# Altium project TIK_HandheldDevice.PrjPcb (part 1 of 2)
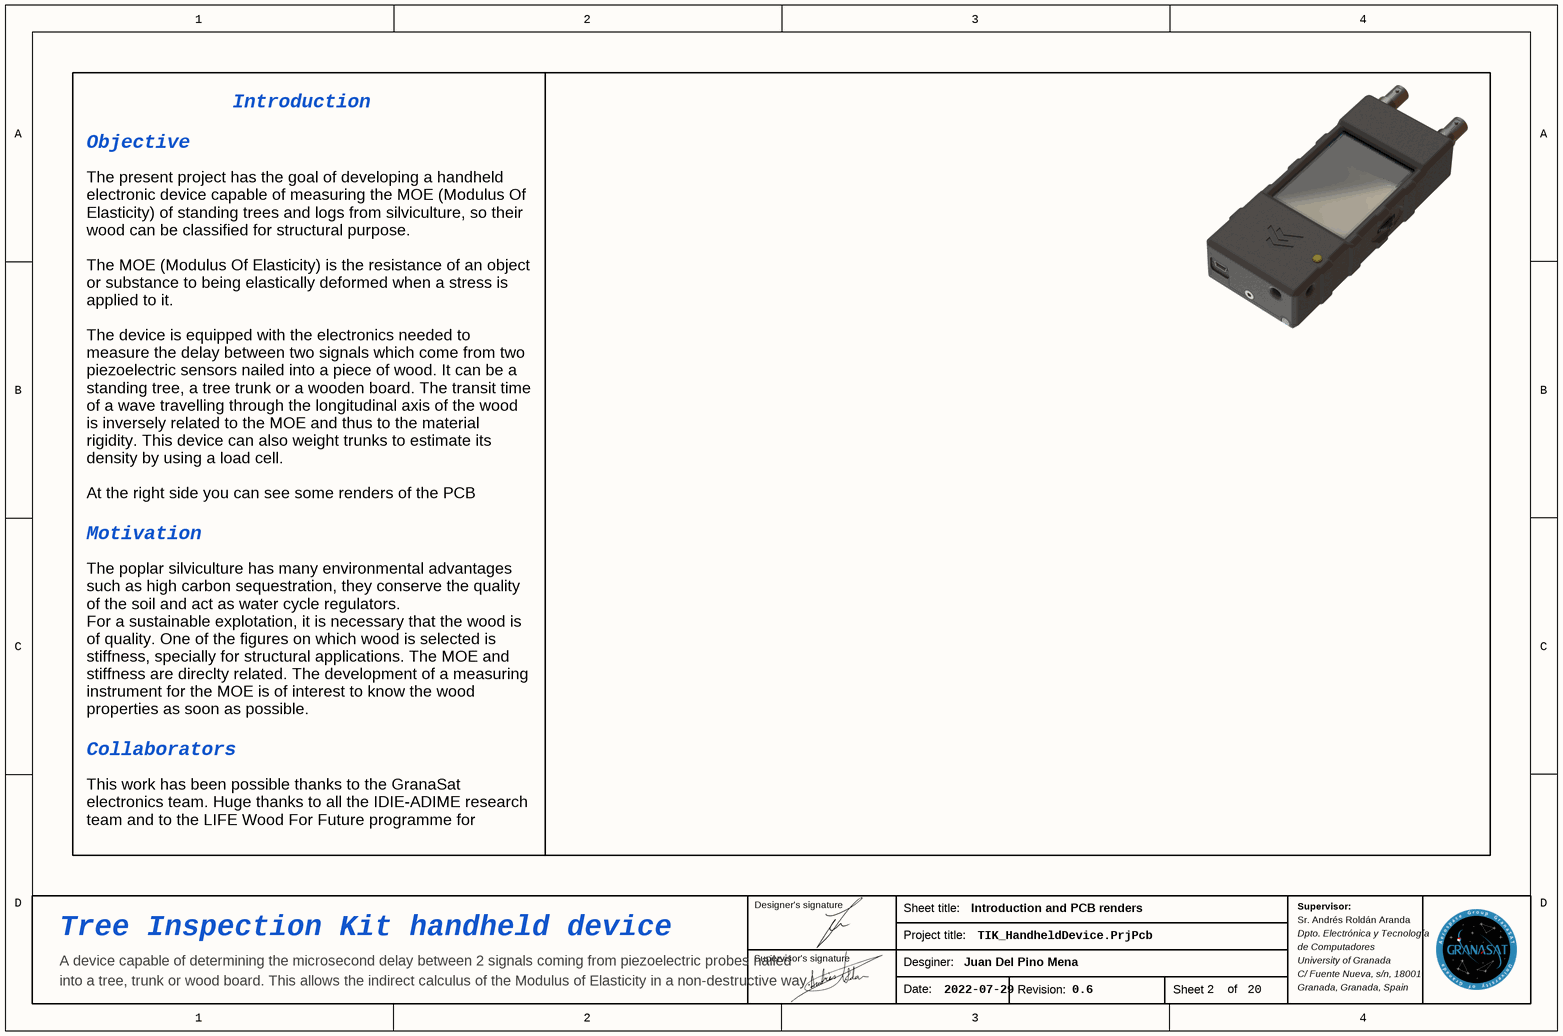
[diagram p0: introduction.SchDoc]
ItemRevision: 6; ProjectAuthor: Juan Del Pino Mena; ProjectDate: 2022-07-29; ProjectRevision: 0.6
21 sheets, 153 parts. Net scope: global (net labels, ports and power ports of the same name join across sheets).
Board file: TIK_PCB.PcbDoc
Sheets:
  cover.SchDoc
  introduction.SchDoc
  changelog.SchDoc
  PCB_traces_vias.SchDoc
  block_diagram.SchDoc
    ESP32-WROOM-32D MCU = esp32_mcu.SchDoc
    SYSTEM POWER RAILS = power_rails.SchDoc
    USB PORT = usb_port.SchDoc
    BUTTONS = buttons.SchDoc
      POWERUP BUTTON = powerup_button.SchDoc
    SIGNAL CONDITIONING = signal_conditioning_circuit.SchDoc
      SIGNAL_CONDITIONING_SIMULATIONS = signal_conditioning_sims1.SchDoc
      Designator = signal_conditioning_sims2.SchDoc
    BATTERY AND CURRENT SENSE = battery_and_current_sense.SchDoc
      CHARGER VARIANT #1: NiMH = battery_charger_ni_mh.SchDoc
      CHARGER VARIANT #2: Li-Ion = battery_charger_li-ion.SchDoc
    MCU AUTO PROGRAMMING = programming.SchDoc
    TFT LCD DISPLAY = tft_lcd_display.SchDoc
    HX711 LOAD CELL AMPLIFIER = HX711_load_cell_amplifier.SchDoc
    EXPANSION_PORT = expansion_port.SchDoc
  power_budget.SchDoc

## Sheet cover.SchDoc
size A4; Date: 2022-07-29; Revision: 0.6; SheetNumber: 1; SheetTotal: 20

### Notes on the sheet
- BACHELOR’S DEGREE IN TELECOMMUNICATION ENGINEERING
- ACADEMIC COURSE 2021/2022
- Tree Inspection Kit
- handheld device
- Part of the Bachelor’s Thesis:
- "Development of an acoustic measurement system of
- the Modulus of Elasticity in trees, logs and boards"
- AUTHOR:
- Sr. Andrés M. Roldán Aranda
- SUPERVISED BY:
- DEPARTMENT:
- Electronics and Computer Technology
- Project title:
- Date:
- Revision:
- Sheet
- of

## Sheet introduction.SchDoc: Introduction and PCB renders
size A4; Date: 2022-07-29; Author: Juan Del Pino Mena; Revision: 0.6; SheetNumber: 2; SheetTotal: 20; TitleBig: Tree Inspection Kit handheld device; Desc_line1: A device capable of determining the microsecond delay between 2 signals coming from piezoelectric probes nailed; Desc_line2: into a tree, trunk or wood board. This allows the indirect calculus of the Modulus of Elasticity in a non-destructive way.

### Notes on the sheet
- Introduction
- Objective
- The present project has the goal of developing a handheld electronic device capable of measuring the MOE (Modulus Of Elasticity) of standing trees and logs from silviculture, so their wood can be classified for structural purpose.
  The MOE (Modulus Of Elasticity) is the resistance of an object or substance to being elastically deformed when a stress is applied to it.
  The device is equipped with the electronics needed to measure the delay between two signals which come from two piezoelectric sensors nailed into a piece of wood. It can be a standing tree, a tree trunk or a wooden board. The transit time of a wave travelling through the longitudinal axis of the wood is inversely related to the MOE and thus to the material rigidity. This device can also weight trunks to estimate its density by using a load cell.
  At the right side you can see some renders of the PCB (version 0.5) which has been manufactured.
- Motivation
- The poplar silviculture has many environmental advantages such as high carbon sequestration, they conserve the quality of the soil and act as water cycle regulators.
  For a sustainable explotation, it is necessary that the wood is of quality. One of the figures on which wood is selected is stiffness, specially for structural applications. The MOE and stiffness are direclty related. The development of a measuring instrument for the MOE is of interest to know the wood properties as soon as possible.
- Collaborators
- This work has been possible thanks to the GranaSat electronics team. Huge thanks to all the IDIE-ADIME research team and to the LIFE Wood For Future programme for offering and financing the project.
- Designer's signature
- Sheet title:
- Sr. Andrés Roldán Aranda
- Supervisor:
- Supervisor's signature
- Project title:
- Desginer:
- Dpto. Electrónica y Tecnología
- de Computadores
- University of Granada
- C/ Fuente Nueva, s/n, 18001
- Granada, Granada, Spain
- Date:
- Revision:
- Sheet
- of

## Sheet changelog.SchDoc: Changelog and document index
size A4; Date: 2022-07-29; Author: Juan Del Pino Mena; Revision: 0.6; SheetNumber: 3; SheetTotal: 20; TitleBig: Document index and revision history; Desc_line1: Detailed changelog and complete document sheets index.; Desc_line2: All along the schematic pages, a sheet title and description will be written on this corner.
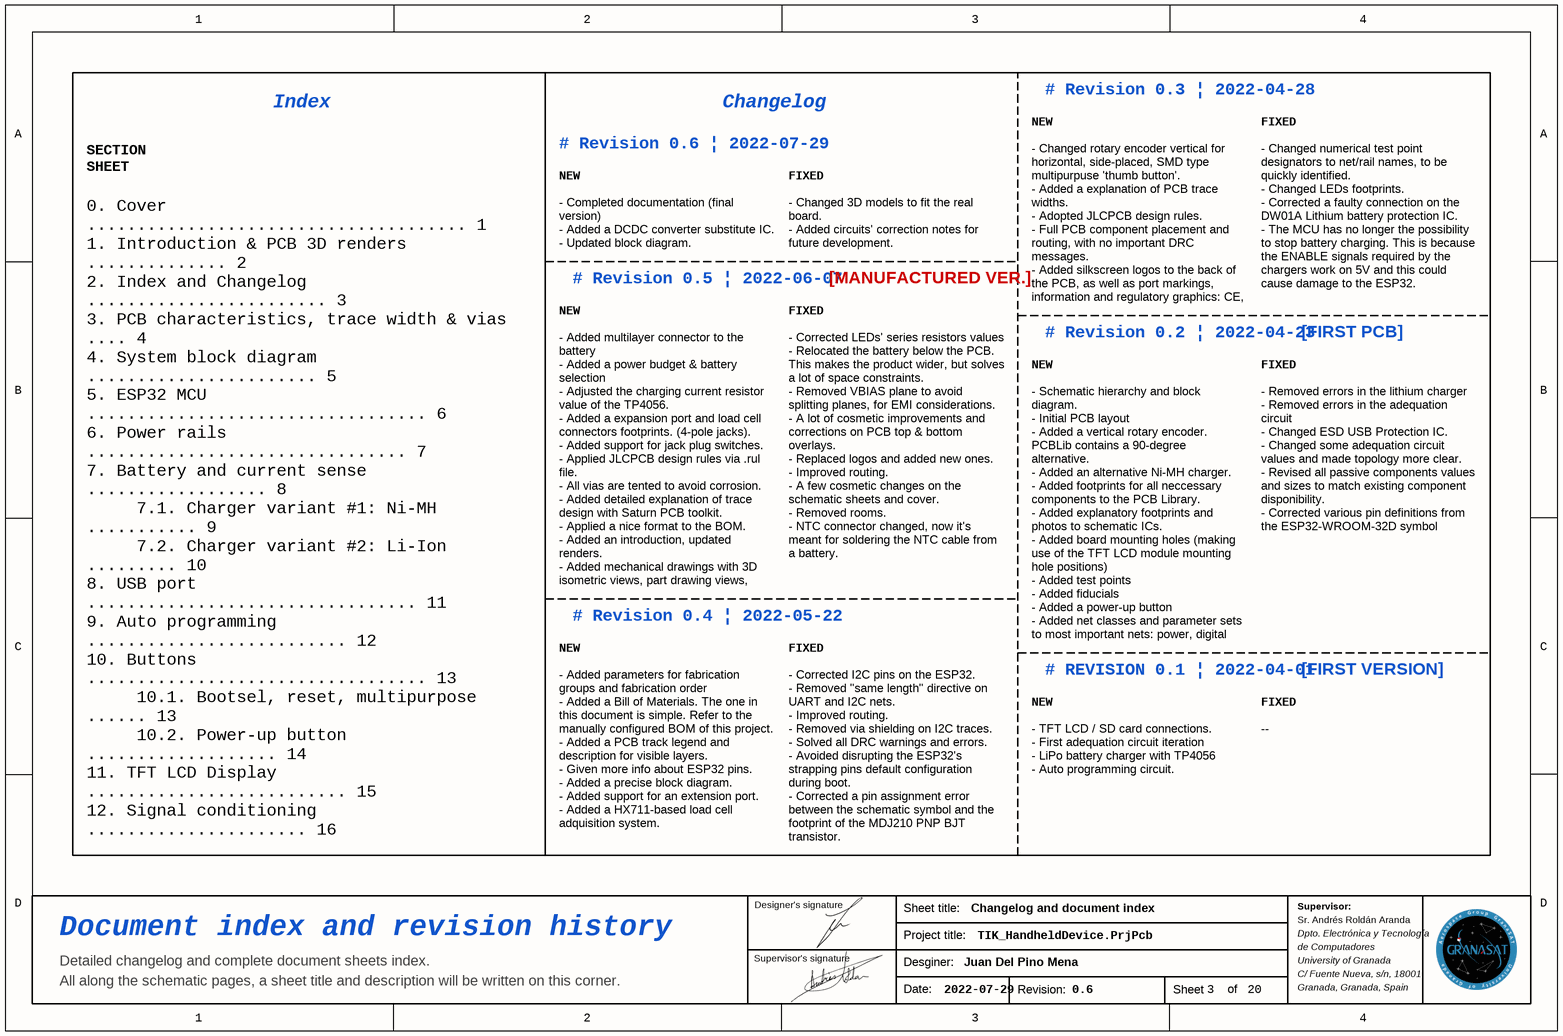
[diagram p1: changelog.SchDoc]

### Notes on the sheet
- Index
- Changelog
- # Revision 0.3 | 2022-04-28
- SECTION                                             SHEET
- # Revision 0.6 | 2022-07-29
- NEW
- FIXED
- - Completed documentation (final version)
  - Added a DCDC converter substitute IC.
  - Updated block diagram.
- - Changed 3D models to fit the real board.
  - Added circuits' correction notes for future development.
- # Revision 0.5 | 2022-06-07
- [MANUFACTURED VER.]
- - Changed rotary encoder vertical for horizontal, side-placed, SMD type multipurpuse 'thumb button'.
  - Added a explanation of PCB trace widths.
  - Adopted JLCPCB design rules.
  - Full PCB component placement and routing, with no important DRC messages.
  - Added silkscreen logos to the back of the PCB, as well as port markings, information and regulatory graphics: CE, WEEE, ESD sensitive warning and RoHS.
- - Changed numerical test point designators to net/rail names, to be quickly identified.
  - Changed LEDs footprints.
  - Corrected a faulty connection on the DW01A Lithium battery protection IC.
  - The MCU has no longer the possibility to stop battery charging. This is because the ENABLE signals required by the chargers work on 5V and this could cause damage to the ESP32.
- # Revision 0.2 | 2022-04-23
- [FIRST PCB]
- - Added multilayer connector to the battery
  - Added a power budget & battery selection
  - Adjusted the charging current resistor value of the TP4056.
  - Added a expansion port and load cell connectors footprints. (4-pole jacks).
  - Added support for jack plug switches.
  - Applied JLCPCB design rules via .rul file.
  - All vias are tented to avoid corrosion.
  - Added detailed explanation of trace design with Saturn PCB toolkit.
  - Applied a nice format to the BOM.
  - Added an introduction, updated renders.
  - Added mechanical drawings with 3D isometric views, part drawing views, measurements, layer stackup, drills, etc.
  - Added Gerber and NC Drills fabrication jobs for ordering PCB and its stencil.
- - Corrected LEDs' series resistors values
  - Relocated the battery below the PCB. This makes the product wider, but solves a lot of space constraints.
  - Removed VBIAS plane to avoid splitting planes, for EMI considerations.
  - A lot of cosmetic improvements and corrections on PCB top & bottom overlays.
  - Replaced logos and added new ones.
  - Improved routing.
  - A few cosmetic changes on the schematic sheets and cover.
  - Removed rooms.
  - NTC connector changed, now it's meant for soldering the NTC cable from a battery.
- # Revision 0.4 | 2022-05-22
- - Schematic hierarchy and block diagram.
  - Initial PCB layout
  - Added a vertical rotary encoder. PCBLib contains a 90-degree alternative.
  - Added an alternative Ni-MH charger.
  - Added footprints for all neccessary components to the PCB Library.
  - Added explanatory footprints and photos to schematic ICs.
  - Added board mounting holes (making use of the TFT LCD module mounting hole positions)
  - Added test points
  - Added fiducials
  - Added a power-up button
  - Added net classes and parameter sets to most important nets: power, digital communications, analog signals, etc.
- - Removed errors in the lithium charger
  - Removed errors in the adequation circuit
  - Changed ESD USB Protection IC.
  - Changed some adequation circuit values and made topology more clear.
  - Revised all passive components values and sizes to match existing component disponibility.
  - Corrected various pin definitions from the ESP32-WROOM-32D symbol
- # REVISION 0.1 | 2022-04-01
- [FIRST VERSION]
- - TFT LCD / SD card connections.
  - First adequation circuit iteration
  - LiPo battery charger with TP4056
  - Auto programming circuit.
- --
- 0. Cover ...................................... 1
  1. Introduction & PCB 3D renders .............. 2
  2. Index and Changelog ........................ 3
  3. PCB characteristics, trace width & vias .... 4
  4. System block diagram ....................... 5
  5. ESP32 MCU .................................. 6
  6. Power rails ................................ 7
  7. Battery and current sense .................. 8
  7.1. Charger variant #1: Ni-MH ........... 9
  7.2. Charger variant #2: Li-Ion ......... 10
  8. USB port  ................................. 11
  9. Auto programming .......................... 12
  10. Buttons .................................. 13
  10.1. Bootsel, reset, multipurpose ...... 13
  10.2. Power-up button ................... 14
  11. TFT LCD Display .......................... 15
  12. Signal conditioning ...................... 16
  12.1. Conditioning circuit .............. 16
  12.2. Circuit simulations 1 ............. 17
  12.3. Circuit simulations 2 ............. 18
  14. Expansion port ........................... 19
  13. Load cell amplifier ...................... 20
  15. Power budget & battery selection ......... 21
  16. 3D PCB (PDF3D) ........................... 22
  17. PCB layers prints ........................ 23
  17.1. Top ............................... 23
  17.2. Bottom ............................ 24
  18. Mechanical schematics (Draftsman) ........ 25
  18.1. Isometric views ................... 25
  18.2. Part views & measurements ......... 26
  18.3. Layer stackup, top/bottom, drills . 27
  18.4. Bill of materials ................. 28
- - Added parameters for fabrication groups and fabrication order
  - Added a Bill of Materials. The one in this document is simple. Refer to the manually configured BOM of this project.
  - Added a PCB track legend and description for visible layers.
  - Given more info about ESP32 pins.
  - Added a precise block diagram.
  - Added support for an extension port.
  - Added a HX711-based load cell adquisition system.
- - Corrected I2C pins on the ESP32.
  - Removed "same length" directive on UART and I2C nets.
  - Improved routing.
  - Removed via shielding on I2C traces.
  - Solved all DRC warnings and errors.
  - Avoided disrupting the ESP32's strapping pins default configuration during boot.
  - Corrected a pin assignment error between the schematic symbol and the footprint of the MDJ210 PNP BJT transistor.
  - Removed PCB cutouts.
- Designer's signature
- Sheet title:
- Sr. Andrés Roldán Aranda
- Supervisor:
- Supervisor's signature
- Project title:
- Desginer:
- Dpto. Electrónica y Tecnología
- de Computadores
- University of Granada
- C/ Fuente Nueva, s/n, 18001
- Granada, Granada, Spain
- Date:
- Revision:
- Sheet
- of

## Sheet PCB_traces_vias.SchDoc: Trace width design
size A4; Date: 2022-07-29; Author: Juan Del Pino Mena; SheetNumber: 4; SheetTotal: 20; TitleBig: Trace & via characteristics; Desc_line1: Trace width based on results from PCB Toolkit by Saturn PCB Design INC.; Desc_line2: Used JLCPCB 2-layer, FR-4, 1.6 mm height, 35 um conductor height (1 oz/ft^2) board characteristics as reference.
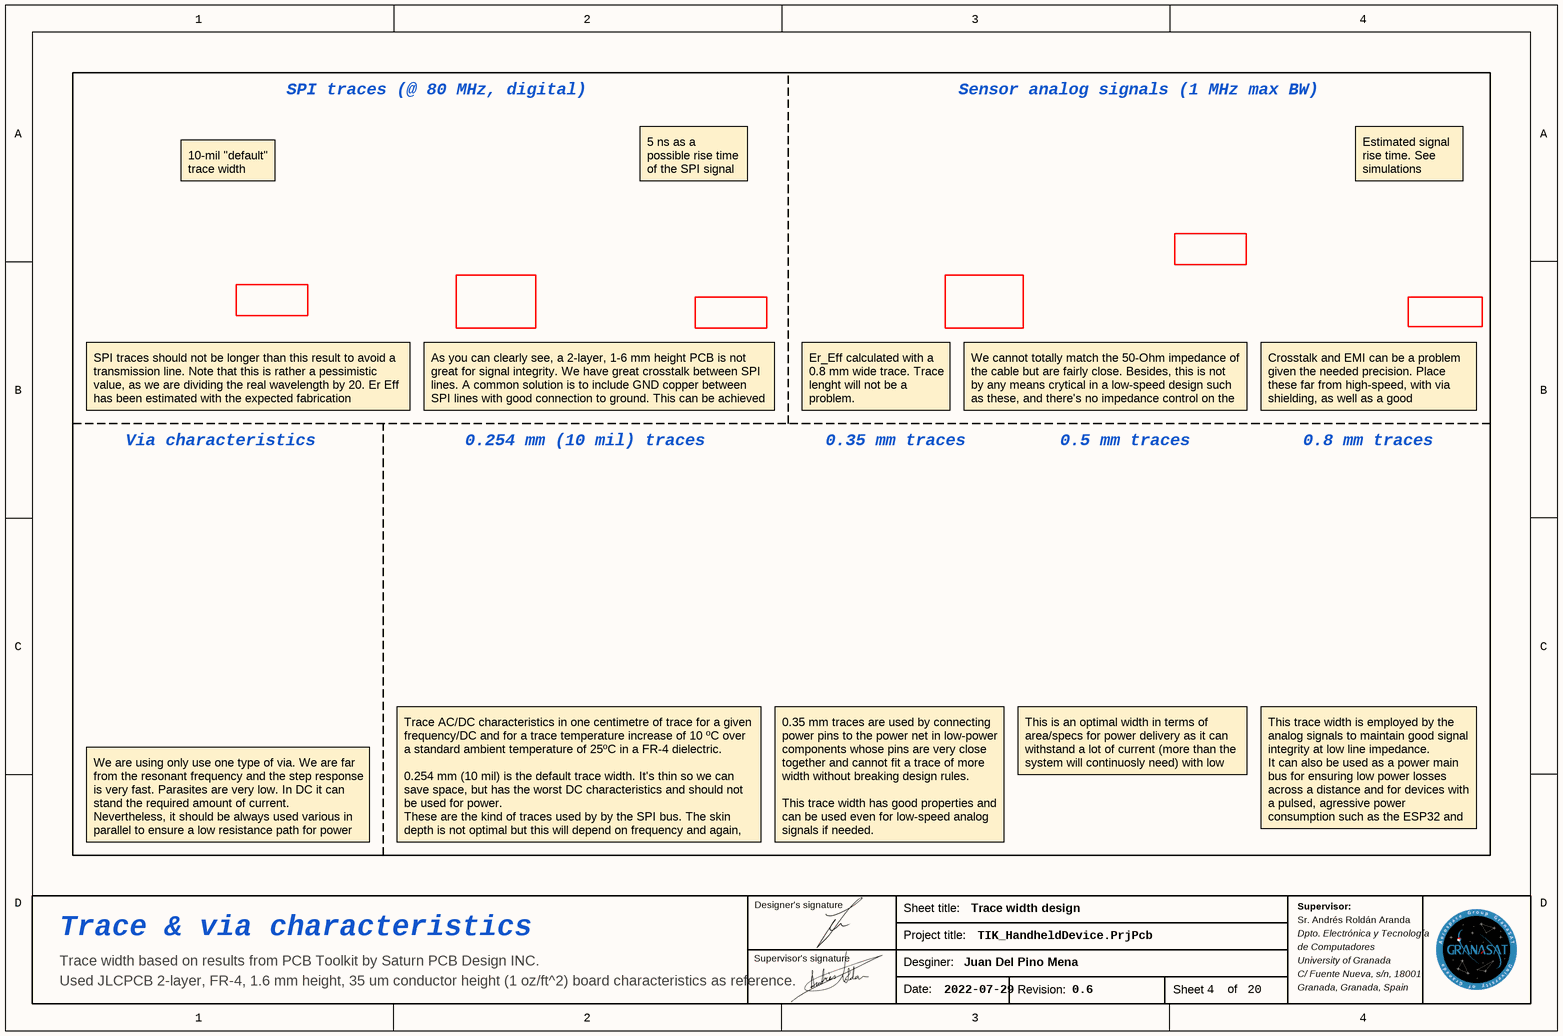
[diagram p2: PCB_traces_vias.SchDoc]

### Notes on the sheet
- SPI traces (@ 80 MHz, digital)
- Sensor analog signals (1 MHz max BW)
- 10-mil "default" trace width
- 5 ns as a possible rise time of the SPI signal
- Estimated signal rise time. See simulations
- SPI traces should not be longer than this result to avoid a transmission line. Note that this is rather a pessimistic value, as we are dividing the real wavelength by 20. Er Eff has been estimated with the expected fabrication characteristics.
- Via characteristics
- As you can clearly see, a 2-layer, 1-6 mm height PCB is not great for signal integrity. We have great crosstalk between SPI lines. A common solution is to include GND copper between SPI lines with good connection to ground. This can be achieved by using via shielding.
- 0.254 mm (10 mil) traces
- Er_Eff calculated with a 0.8 mm wide trace. Trace lenght will not be a problem.
- 0.35 mm traces
- We cannot totally match the 50-Ohm impedance of the cable but are fairly close. Besides, this is not by any means crytical in a low-speed design such as these, and there's no impedance control on the end of the lines
- 0.5 mm traces
- Crosstalk and EMI can be a problem given the needed precision. Place these far from high-speed, with via shielding, as well as a good GND/power planes below.
- 0.8 mm traces
- This is an optimal width in terms of area/specs for power delivery as it can withstand a lot of current (more than the system will continuosly need) with low losses.
- We are using only use one type of via. We are far from the resonant frequency and the step response is very fast. Parasites are very low. In DC it can stand the required amount of current. Nevertheless, it should be always used various in parallel to ensure a low resistance path for power and returning currents.
- Trace AC/DC characteristics in one centimetre of trace for a given frequency/DC and for a trace temperature increase of 10 ºC over a standard ambient temperature of 25ºC in a FR-4 dielectric.
  0.254 mm (10 mil) is the default trace width. It's thin so we can save space, but has the worst DC characteristics and should not be used for power.
  These are the kind of traces used by by the SPI bus. The skin depth is not optimal but this will depend on frequency and again, AC current is not a crytical aspect here. It's a "good enough" approach.
- 0.35 mm traces are used by connecting power pins to the power net in low-power components whose pins are very close together and cannot fit a trace of more width without breaking design rules.
  This trace width has good properties and can be used even for low-speed analog signals if needed.
- This trace width is employed by the analog signals to maintain good signal integrity at low line impedance.
  It can also be used as a power main bus for ensuring low power losses across a distance and for devices with a pulsed, agressive power consumption such as the ESP32 and the LCD.
- Designer's signature
- Sheet title:
- Sr. Andrés Roldán Aranda
- Supervisor:
- Supervisor's signature
- Project title:
- Desginer:
- Dpto. Electrónica y Tecnología
- de Computadores
- University of Granada
- C/ Fuente Nueva, s/n, 18001
- Granada, Granada, Spain
- Date:
- Revision:
- Sheet
- of

## Sheet block_diagram.SchDoc: System blocks organization and connections
size A4; Date: 2022-07-29; Author: Juan Del Pino Mena; Revision: 0.6; SheetNumber: 5; SheetTotal: 20; TitleBig: System blocks organization and connections; Desc_line1: The project's global block diagram. Arrows show how modules are interconnected and include net names.; Desc_line2: PCB includes 3 fiducials for fabrication purposes. GND test points are distributed along the PCB for easy access.
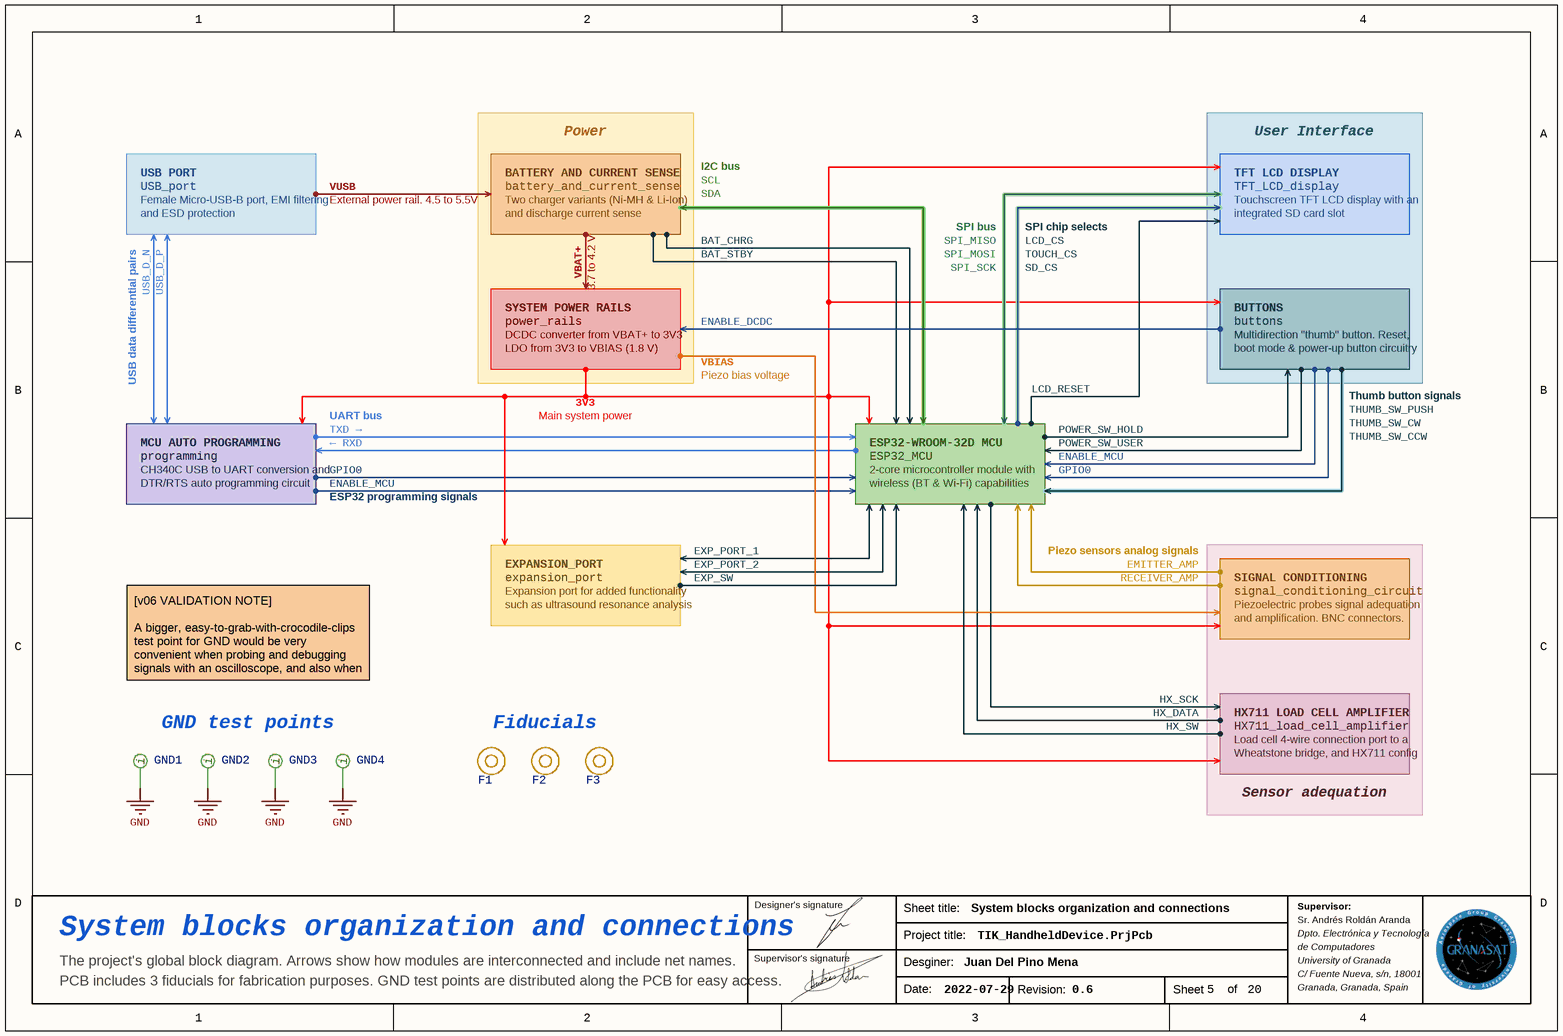
[diagram p3: block_diagram.SchDoc]

### Parts
F1  Fiducial_1mm_2mm  [FIDUCIAL_1MM_2MM]  (value not drawn)  (no BOM)
F2  Fiducial_1mm_2mm  [FIDUCIAL_1MM_2MM]  (value not drawn)  (no BOM)
F3  Fiducial_1mm_2mm  [FIDUCIAL_1MM_2MM]  (value not drawn)  (no BOM)
GND1  Test Point Pad dual sided  [TEST POINT PAD]  (value not drawn)  (no BOM)
GND2  Test Point Pad dual sided  [TEST POINT PAD]  (value not drawn)  (no BOM)
GND3  Test Point Pad dual sided  [TEST POINT PAD]  (value not drawn)  (no BOM)
GND4  Test Point Pad dual sided  [TEST POINT PAD]  (value not drawn)  (no BOM)

### Sub-sheets
BATTERY AND CURRENT SENSE = battery_and_current_sense: no entries
BUTTONS = buttons: no entries
ESP32-WROOM-32D MCU = ESP32_MCU: no entries
EXPANSION_PORT = expansion_port: no entries
HX711 LOAD CELL AMPLIFIER = HX711_load_cell_amplifier: no entries
MCU AUTO PROGRAMMING = programming: no entries
SIGNAL CONDITIONING = signal_conditioning_circuit: no entries
SYSTEM POWER RAILS = power_rails: no entries
TFT LCD DISPLAY = TFT_LCD_display: no entries
USB PORT = USB_port: no entries

### Nets
GND: GND1.1 GND2.1 GND3.1 GND4.1

### Notes on the sheet
- Power
- I2C bus
- User Interface
- USB data differential pairs
- Female Micro-USB-B port, EMI filtering
- and ESD protection
- USB_D_N
- USB_D_P
- VUSB
- External power rail. 4.5 to 5.5V
- Two charger variants (Ni-MH & Li-Ion)
- and discharge current sense
- SDA
- SCL
- BAT_CHRG
- SPI bus
- SPI_MISO
- SPI chip selects
- LCD_CS
- Touchscreen TFT LCD display with an
- integrated SD card slot
- VBAT+
- 3.7 to 4.2 V
- BAT_STBY
- SPI_MOSI
- SPI_SCK
- TOUCH_CS
- SD_CS
- DCDC converter from VBAT+ to 3V3
- LDO from 3V3 to VBIAS (1.8 V)
- ENABLE_DCDC
- VBIAS
- Piezo bias voltage
- Multidirection "thumb" button. Reset,
- boot mode & power-up button circuitry
- TXD →
- ← RXD
- UART bus
- 3V3
- Main system power
- LCD_RESET
- POWER_SW_USER
- POWER_SW_HOLD
- Thumb button signals
- THUMB_SW_CW
- THUMB_SW_PUSH
- THUMB_SW_CCW
- CH340C USB to UART conversion and
- DTR/RTS auto programming circuit
- GPIO0
- ENABLE_MCU
- ESP32 programming signals
- 2-core microcontroller module with
- wireless (BT & Wi-Fi) capabilities
- EXP_PORT_1
- EXP_PORT_2
- EXP_SW
- EMITTER_AMP
- RECEIVER_AMP
- Piezo sensors analog signals
- Expansion port for added functionality
- such as ultrasound resonance analysis
- Piezoelectric probes signal adequation
- and amplification. BNC connectors.
- [v06 VALIDATION NOTE]
  A bigger, easy-to-grab-with-crocodile-clips test point for GND would be very convenient when probing and debugging signals with an oscilloscope, and also when injecting voltage.
- HX_SCK
- HX_DATA
- GND test points
- Fiducials
- HX_SW
- Load cell 4-wire connection port to a
- Wheatstone bridge, and HX711 config
- Sensor adequation
- Designer's signature
- Sheet title:
- Sr. Andrés Roldán Aranda
- Supervisor:
- Supervisor's signature
- Project title:
- Desginer:
- Dpto. Electrónica y Tecnología
- de Computadores
- University of Granada
- C/ Fuente Nueva, s/n, 18001
- Granada, Granada, Spain
- Date:
- Revision:
- Sheet
- of
- (in symbol Test Point Pad dual sided) i

### Library data of the parts
F1-F3 = Fiducial_1mm_2mm: Fiducial 1mm pad, 2mm solder resist
GND1-GND4 = Test Point Pad dual sided: Test point - PCB Pad dual sided

## Sheet esp32_mcu.SchDoc: ESP32-WROOM-32D MCU
size A4; Date: 2022-07-29; Author: Juan Del Pino Mena; Revision: 0.6; SheetNumber: 6; SheetTotal: 20; TitleBig: ESP32-WROOM-32D MCU, Wi-Fi + Bluetooth module; Desc_line1: This module integrates an ESP32-D0WD chip, a 240 MHz, dual-core processor with Wi-Fi and Bluetooth capabilities.; Desc_line2: This sheet describes its hardware configuration and I/O pins
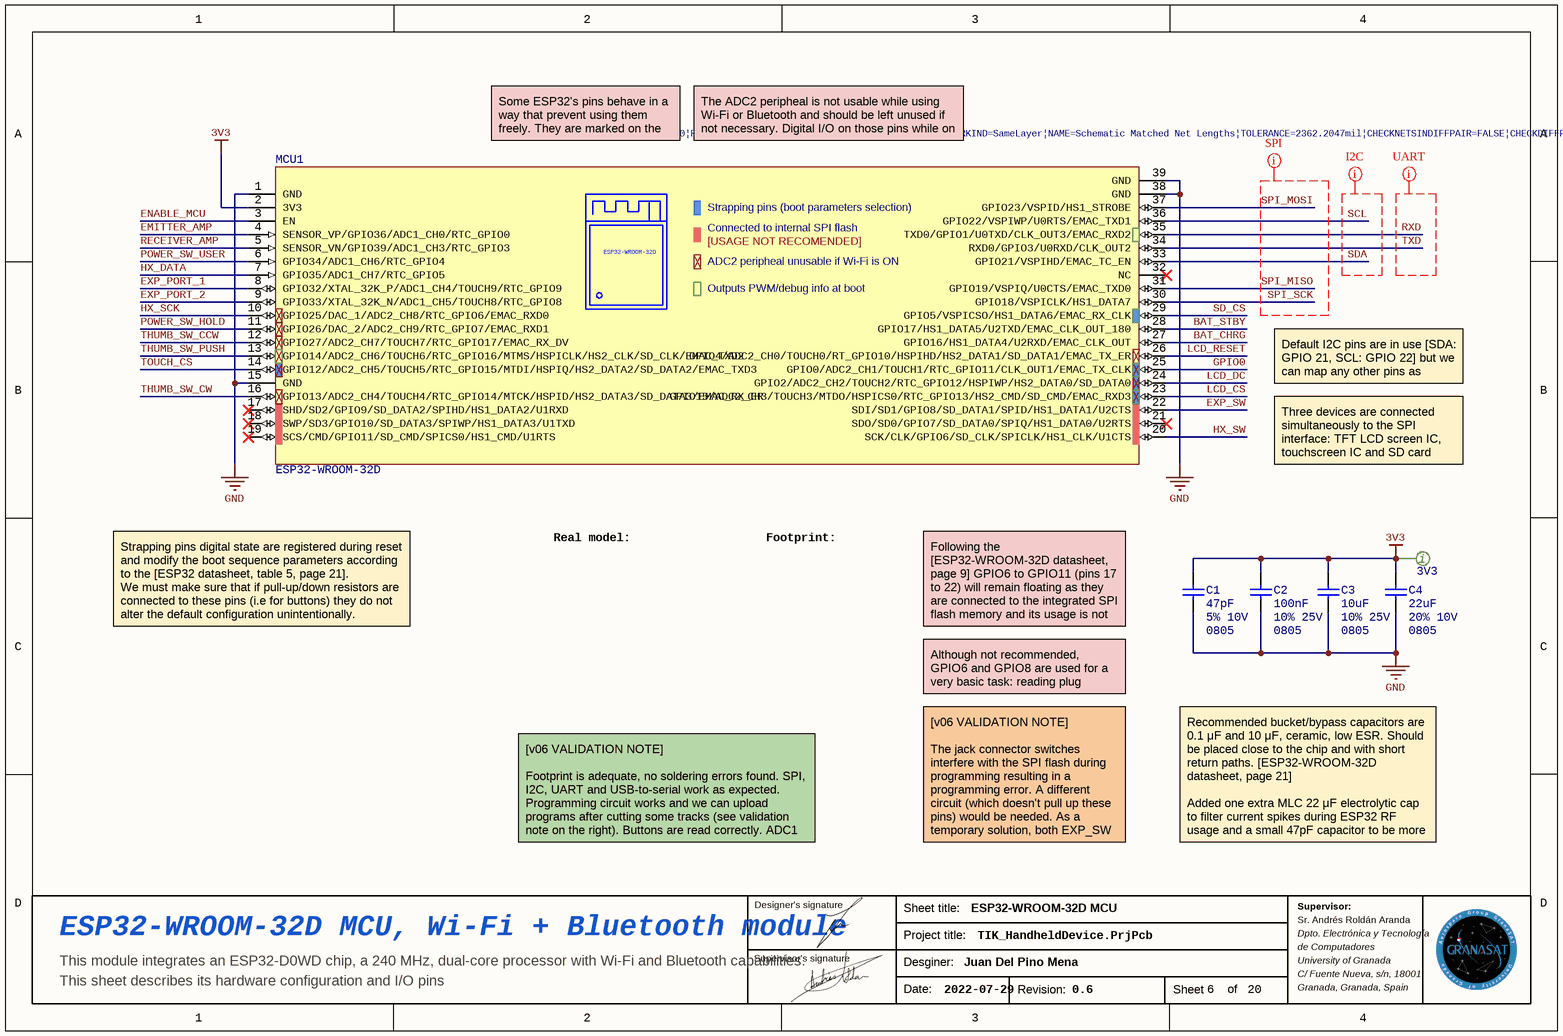
[diagram p4: esp32_mcu.SchDoc]

### Parts
3V3  Test Point Pad dual sided  [TEST POINT PAD]  (value not drawn)  (no BOM)
C1  value 47pF  Tolerance: 5% 10V  PackageDescription: 0805  [CAP 0805_2012]  (hidden comment: Cap_cer_0805)
C2  value 100nF  Tolerance: 10% 25V  PackageDescription: 0805  [CAP 0805_2012]  (hidden comment: Cap_cer_0805)
C3  value 10uF  Tolerance: 10% 25V  PackageDescription: 0805  [CAP 0805_2012]  (hidden comment: Cap_cer_0805)
C4  value 22uF  Tolerance: 20% 10V  PackageDescription: 0805  [CAP 0805_2012]  (hidden comment: Cap_cer_0805)
MCU1  Part: ESP32-WROOM-32D  [MODULE_ESP32-WROOM-32]  (hidden comment: MCU ESP32-WROOM-32D)

### Nets
3V3: 3V3.1 C1.2 C2.2 C3.2 C4.2 MCU1.2(3V3)
GND: C1.1 C2.1 C3.1 C4.1 MCU1.1(GND) MCU1.15(GND) MCU1.38(GND) MCU1.39(GND)
BAT_CHRG: MCU1.27(GPIO16/HS1_DATA4/U2RXD/EMAC_CLK_OUT)
BAT_STBY: MCU1.28(GPIO17/HS1_DATA5/U2TXD/EMAC_CLK_OUT_180)
EMITTER_AMP: MCU1.4(SENSOR_VP/GPIO36/ADC1_CH0/RTC_GPIO0)
ENABLE_MCU: MCU1.3(EN)
EXP_PORT_1: MCU1.8(GPIO32/XTAL_32K_P/ADC1_CH4/TOUCH9/RTC_GPIO9)
EXP_PORT_2: MCU1.9(GPIO33/XTAL_32K_N/ADC1_CH5/TOUCH8/RTC_GPIO8)
EXP_SW: MCU1.22(SDI/SD1/GPIO8/SD_DATA1/SPID/HS1_DATA1/U2CTS)
GPIO0: MCU1.25(GPIO0/ADC2_CH1/TOUCH1/RTC_GPIO11/CLK_OUT1/EMAC_TX_CLK)
HX_DATA: MCU1.7(GPIO35/ADC1_CH7/RTC_GPIO5)
HX_SCK: MCU1.10(GPIO25/DAC_1/ADC2_CH8/RTC_GPIO6/EMAC_RXD0)
HX_SW: MCU1.20(SCK/CLK/GPIO6/SD_CLK/SPICLK/HS1_CLK/U1CTS)
LCD_CS: MCU1.23(GPIO15/ADC2_CH3/TOUCH3/MTDO/HSPICS0/RTC_GPIO13/HS2_CMD/SD_CMD/EMAC_RXD3)
LCD_DC: MCU1.24(GPIO2/ADC2_CH2/TOUCH2/RTC_GPIO12/HSPIWP/HS2_DATA0/SD_DATA0)
LCD_RESET: MCU1.26(GPIO4/ADC2_CH0/TOUCH0/RT_GPIO10/HSPIHD/HS2_DATA1/SD_DATA1/EMAC_TX_ER)
POWER_SW_HOLD: MCU1.11(GPIO26/DAC_2/ADC2_CH9/RTC_GPIO7/EMAC_RXD1)
POWER_SW_USER: MCU1.6(GPIO34/ADC1_CH6/RTC_GPIO4)
RECEIVER_AMP: MCU1.5(SENSOR_VN/GPIO39/ADC1_CH3/RTC_GPIO3)
RXD: MCU1.35(TXD0/GPIO1/U0TXD/CLK_OUT3/EMAC_RXD2)
SCL: MCU1.36(GPIO22/VSPIWP/U0RTS/EMAC_TXD1)
SD_CS: MCU1.29(GPIO5/VSPICSO/HS1_DATA6/EMAC_RX_CLK)
SDA: MCU1.33(GPIO21/VSPIHD/EMAC_TC_EN)
SPI_MISO: MCU1.31(GPIO19/VSPIQ/U0CTS/EMAC_TXD0)
SPI_MOSI: MCU1.37(GPIO23/VSPID/HS1_STROBE)
SPI_SCK: MCU1.30(GPIO18/VSPICLK/HS1_DATA7)
THUMB_SW_CCW: MCU1.12(GPIO27/ADC2_CH7/TOUCH7/RTC_GPIO17/EMAC_RX_DV)
THUMB_SW_CW: MCU1.16(GPIO13/ADC2_CH4/TOUCH4/RTC_GPIO14/MTCK/HSPID/HS2_DATA3/SD_DATA3/EMAC_RX_ER)
THUMB_SW_PUSH: MCU1.13(GPIO14/ADC2_CH6/TOUCH6/RTC_GPIO16/MTMS/HSPICLK/HS2_CLK/SD_CLK/EMAC_TXD2)
TOUCH_CS: MCU1.14(GPIO12/ADC2_CH5/TOUCH5/RTC_GPIO15/MTDI/HSPIQ/HS2_DATA2/SD_DATA2/EMAC_TXD3)
TXD: MCU1.34(RXD0/GPIO3/U0RXD/CLK_OUT2)

Not connected (* = marked no-connect by the designer): MCU1 17(SHD/SD2/GPIO9/SD_DATA2/SPIHD/HS1_DATA2/U1RXD)* 18(SWP/SD3/GPIO10/SD_DATA3/SPIWP/HS1_DATA3/U1TXD)* 19(SCS/CMD/GPIO11/SD_CMD/SPICS0/HS1_CMD/U1RTS)* 21(SDO/SD0/GPIO7/SD_DATA0/SPIQ/HS1_DATA0/U2RTS)* 32(NC)*

### Layout directives
net class I2C; rule Matched Net Lengths [Tolerance = 100mm]: SCL, SDA
net class UART; rule Matched Net Lengths [Tolerance = 100mm]: RXD, TXD
net class SPI; rule Matched Net Lengths [Tolerance = 60mm]: SPI_MISO, SPI_MOSI, SPI_SCK

### Notes on the sheet
- (near MCU1) Some ESP32's pins behave in a way that prevent using them freely. They are marked on the legend below.
- (near MCU1) The ADC2 peripheal is not usable while using Wi-Fi or Bluetooth and should be left unused if not necessary. Digital I/O on those pins while on Wi-Fi or BT is fine.
- Default I2C pins are in use [SDA: GPIO 21, SCL: GPIO 22] but we can map any other pins as hardware I2C.
- Three devices are connected simultaneously to the SPI interface: TFT LCD screen IC, touchscreen IC and SD card reader.
- Real model:
- Footprint:
- Strapping pins digital state are registered during reset and modify the boot sequence parameters according to the [ESP32 datasheet, table 5, page 21].
  We must make sure that if pull-up/down resistors are connected to these pins (i.e for buttons) they do not alter the default configuration unintentionally.
- Following the [ESP32-WROOM-32D datasheet, page 9] GPIO6 to GPIO11 (pins 17 to 22) will remain floating as they are connected to the integrated SPI flash memory and its usage is not recommended for other uses.
- Although not recommended, GPIO6 and GPIO8 are used for a very basic task: reading plug switches.
- [v06 VALIDATION NOTE]
  Footprint is adequate, no soldering errors found. SPI, I2C, UART and USB-to-serial work as expected. Programming circuit works and we can upload programs after cutting some tracks (see validation note on the right). Buttons are read correctly. ADC1 can register analog signals correctly.
- [v06 VALIDATION NOTE]
  The jack connector switches interfere with the SPI flash during programming resulting in a programming error. A different circuit (which doesn't pull up these pins) would be needed. As a temporary solution, both EXP_SW and HX_SW tracks were cut in the PCB.
- Recommended bucket/bypass capacitors are 0.1 μF and 10 μF, ceramic, low ESR. Should be placed close to the chip and with short return paths. [ESP32-WROOM-32D datasheet, page 21]
  Added one extra MLC 22 μF electrolytic cap to filter current spikes during ESP32 RF usage and a small 47pF capacitor to be more effective filtering high frequencies
- Designer's signature
- Sheet title:
- Sr. Andrés Roldán Aranda
- Supervisor:
- Supervisor's signature
- Project title:
- Desginer:
- Dpto. Electrónica y Tecnología
- de Computadores
- University of Granada
- C/ Fuente Nueva, s/n, 18001
- Granada, Granada, Spain
- Date:
- Revision:
- Sheet
- of
- (in symbol MCU ESP32-WROOM-32D) Strapping pins (boot parameters selection); Connected to internal SPI flash; [USAGE NOT RECOMENDED]; ADC2 peripheal unusable if Wi-Fi is ON; Outputs PWM/debug info at boot
- (in symbol Test Point Pad dual sided) i

### Library data of the parts
3V3 = Test Point Pad dual sided: Test point - PCB Pad dual sided
C1 = Cap_cer_0805_47pF_5%: Ceramic cap size 0805; FabGroup: Microcontroller; FabOrder: 1
C2 = Cap_cer_0805_100nF_10%: Ceramic cap size 0805; FabGroup: Microcontroller; FabOrder: 1
C3 = Cap_cer_0805_10uF_10%: Ceramic cap size 0805; FabGroup: Microcontroller; FabOrder: 1
C4 = Cap_cer_0805_22uF_20%: Ceramic cap size 0805 CC0805MKX5R6BB226 Yageo MLCC 22uF 10V 20% X5R
MCU1 = MCU ESP32-WROOM-32D: - Transceiver; 802.11 b/g/n _Wi-Fi, WiFi, WLAN_, Bluetooth Smart Ready 4.x Dual Mode For Use With ESP-WROOM-32; MF: Espressif Systems; FabGroup: Microcontroller; FabOrder: 1; Package: None; Price: None; Availability: Unavailable; MP: ESP32-WROOM-32D; SnapEDA_Link: https://www.snapeda.com/parts/ESP32-DEVKITC-32D/Espressif%20Systems/view-part/2777395/?ref=snap; Value: *

## Sheet power_rails.SchDoc: Power rails
size A4; Date: 2022-07-29; Author: Juan Del Pino Mena; Revision: 0.6; SheetNumber: 7; SheetTotal: 20; TitleBig: Power rails; Desc_line1: Battery DC/DC step-down converter and Vbias for signal conditioning circuit. 3V3 is the main system power and can; Desc_line2: deliver upto 2 amps. VBIAS is only for polarization of the probes and won't drag much current.
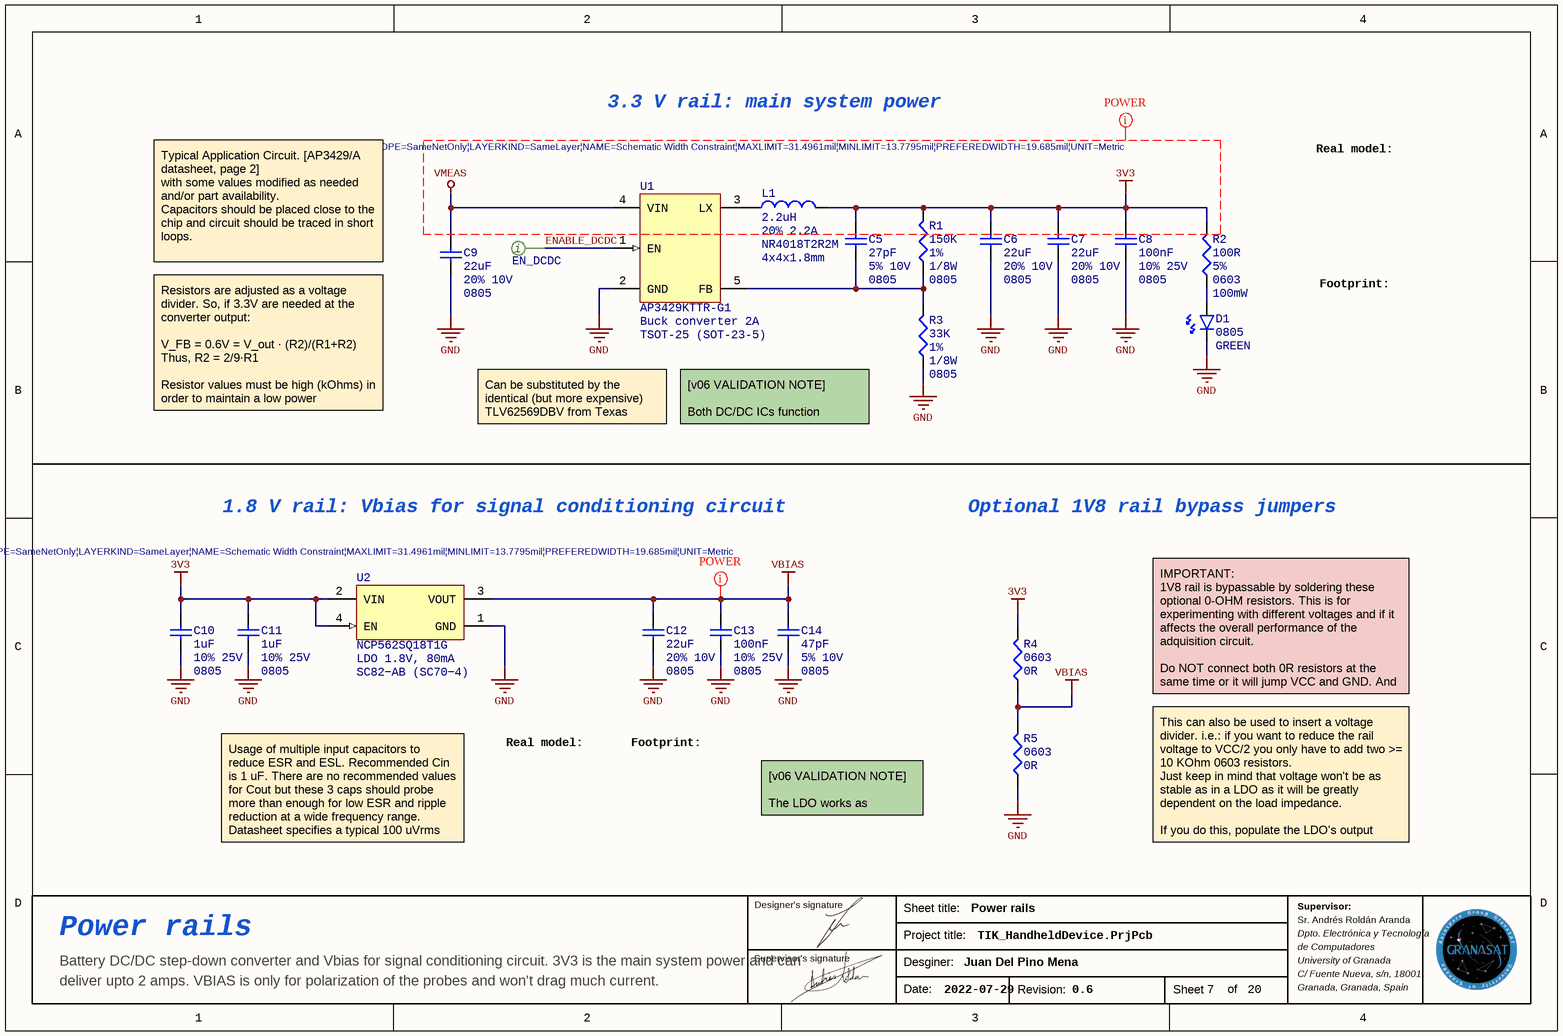
[diagram p5: power_rails.SchDoc]

### Parts
C5  value 27pF  Tolerance: 5% 10V  PackageDescription: 0805  [CAP 0805_2012]  (hidden comment: Cap_cer_0805)
C6  value 22uF  Tolerance: 20% 10V  PackageDescription: 0805  [CAP 0805_2012]  (hidden comment: Cap_cer_0805)
C7  value 22uF  Tolerance: 20% 10V  PackageDescription: 0805  [CAP 0805_2012]  (hidden comment: Cap_cer_0805)
C8  value 100nF  Tolerance: 10% 25V  PackageDescription: 0805  [CAP 0805_2012]  (hidden comment: Cap_cer_0805)
C9  value 22uF  Tolerance: 20% 10V  PackageDescription: 0805  [CAP 0805_2012]  (hidden comment: Cap_cer_0805)
C10  value 1uF  Tolerance: 10% 25V  PackageDescription: 0805  [CAP 0805_2012]  (hidden comment: Cap_cer_0805)
C11  value 1uF  Tolerance: 10% 25V  PackageDescription: 0805  [CAP 0805_2012]  (hidden comment: Cap_cer_0805)
C12  value 22uF  Tolerance: 20% 10V  PackageDescription: 0805  [CAP 0805_2012]  (hidden comment: Cap_cer_0805)
C13  value 100nF  Tolerance: 10% 25V  PackageDescription: 0805  [CAP 0805_2012]  (hidden comment: Cap_cer_0805)
C14  value 47pF  Tolerance: 5% 10V  PackageDescription: 0805  [CAP 0805_2012]  (hidden comment: Cap_cer_0805)
D1  PackageDescription: 0805  Type: GREEN  [LED 0805_2012 GREEN]  (hidden comment: Diode LED_G_0805)
EN_DCDC  Test Point Pad dual sided  [TEST POINT PAD]  (value not drawn)  (no BOM)
L1  value 2.2uH  Tolerance: 20% 2.2A  Part: NR4018T2R2M  PackageDescription: 4x4x1.8mm  [Inductor 4x4mm]  (hidden comment: Ind 2uH_Wire_Shield_2A_4x4)
R1  value 150K  Tolerance: 1%  PowerDisipated: 1/8W  PackageDescription: 0805  [RES 0805_2012]  (hidden comment: Res_0805_150K_1%_1/8W)
R2  value 100R  Tolerance: 5%  PackageDescription: 0603  PowerDisipated: 100mW  [RES 0603_1608]  (hidden comment: Res_0603_100R_5%_100mW)
R3  value 33K  Tolerance: 1%  PowerDisipated: 1/8W  PackageDescription: 0805  [RES 0805_2012]  (hidden comment: Res_0805_33K_1%_1/8W)
R4  value 0R  PackageDescription: 0603  [RES 0603_1608]  (hidden comment: Res_0603_0ohm)
R5  value 0R  PackageDescription: 0603  [RES 0603_1608]  (hidden comment: Res_0603_0ohm)
U1  Part: AP3429KTTR-G1  Type: Buck converter 2A  PackageDescription: TSOT-25 (SOT-23-5)  [SOT-23-5 AP3429]  (hidden comment: AP3429_A)
U2  value LDO 1.8V, 80mA  Part: NCP562SQ18T1G  PackageDescription: SC82−AB (SC70−4)  [SC70-5 LT SC82-AB NCP562]  (hidden comment: IC NCP562SQ18T1G LDO)

### Nets
3V3: C5.2 C6.2 C7.2 C8.2 C10.2 C11.2 L1.2 R1.2 R2.2 R4.2 U2.2(VIN) U2.4(EN)
GND: C6.1 C7.1 C8.1 C9.1 C10.1 C11.1 C12.1 C13.1 C14.1 D1.2 R3.1 R5.1 U1.2(GND) U2.1(GND)
VBIAS: C12.2 C13.2 C14.2 R4.1 R5.2 U2.3(VOUT)
VMEAS: C9.2 U1.4(VIN)
ENABLE_DCDC: EN_DCDC.1 U1.1(EN)
NetC5_1: C5.1 R1.1 R3.2 U1.5(FB)
NetD1_1: D1.1 R2.1
NetL1_1: L1.1 U1.3(LX)

### Layout directives
net class POWER; rule Width Constraint [Pref Width = 0.5mm    Min Width = 0.35mm    Max Width = 0.8mm]: 3V3, VBIAS, VMEAS

### Notes on the sheet
- 3.3 V rail: main system power
- Real model:
- Typical Application Circuit. [AP3429/A datasheet, page 2]
  with some values modified as needed and/or part availability.
  Capacitors should be placed close to the chip and circuit should be traced in short loops.
  Feedback voltage V_FB is regulated at 0.6 V.
- Footprint:
- Resistors are adjusted as a voltage divider. So, if 3.3V are needed at the converter output:
  V_FB = 0.6V = V_out · (R2)/(R1+R2)
  Thus, R2 = 2/9·R1
  Resistor values must be high (kOhms) in order to maintain a low power consumption on the feedback circuit.
- Can be substituted by the identical (but more expensive) TLV62569DBV from Texas Instruments
- [v06 VALIDATION NOTE]
  Both DC/DC ICs function properly.
- 1.8 V rail: Vbias for signal conditioning circuit
- Optional 1V8 rail bypass jumpers
- IMPORTANT:
  1V8 rail is bypassable by soldering these optional 0-OHM resistors. This is for experimenting with different voltages and if it affects the overall performance of the adquisition circuit.
  Do NOT connect both 0R resistors at the same time or it will jump VCC and GND. And keep the LDO disabled at all times.
- Usage of multiple input capacitors to reduce ESR and ESL. Recommended Cin is 1 uF. There are no recommended values for Cout but these 3 caps should probe more than enough for low ESR and ripple reduction at a wide frequency range.
  Datasheet specifies a typical 100 uVrms noise on Vout, somewhat high.
- [v06 VALIDATION NOTE]
  The LDO works as expected.
- This can also be used to insert a voltage divider. i.e.: if you want to reduce the rail voltage to VCC/2 you only have to add two >= 10 KOhm 0603 resistors.
  Just keep in mind that voltage won't be as stable as in a LDO as it will be greatly dependent on the load impedance.
  If you do this, populate the LDO's output caps, so VBIAS it behaves as a small-signal GND.
- Designer's signature
- Sheet title:
- Sr. Andrés Roldán Aranda
- Supervisor:
- Supervisor's signature
- Project title:
- Desginer:
- Dpto. Electrónica y Tecnología
- de Computadores
- University of Granada
- C/ Fuente Nueva, s/n, 18001
- Granada, Granada, Spain
- Date:
- Revision:
- Sheet
- of
- (in symbol Test Point Pad dual sided) i

### Library data of the parts
C5 = Cap_cer_0805_27pF_5%: Ceramic cap size 0805; FabGroup: DCDC converter; FabOrder: 2
C6 C7 C9 = Cap_cer_0805_22uF_20%: Ceramic cap size 0805 CC0805MKX5R6BB226 Yageo MLCC 22uF 10V 20% X5R; FabGroup: DCDC converter; FabOrder: 2
C8 = Cap_cer_0805_100nF_10%: Ceramic cap size 0805; FabGroup: DCDC converter; FabOrder: 2
C10 C11 = Cap_cer_0805_1uF_10%: Ceramic cap size 0805; FabGroup: LDO Regulator & LDO bypass; FabOrder: 12
C12 = Cap_cer_0805_22uF_20%: Ceramic cap size 0805 CC0805MKX5R6BB226 Yageo MLCC 22uF 10V 20% X5R; FabGroup: LDO Regulator & LDO bypass; FabOrder: 12
C13 = Cap_cer_0805_100nF_10%: Ceramic cap size 0805; FabGroup: LDO Regulator & LDO bypass; FabOrder: 12
C14 = Cap_cer_0805_47pF_5%: Ceramic cap size 0805; FabGroup: LDO Regulator & LDO bypass; FabOrder: 12
D1 = Diode LED_G_0805: Low power LED color Green; FabGroup: DCDC converter; FabOrder: 2
EN_DCDC = Test Point Pad dual sided: Test point - PCB Pad dual sided
L1 = Ind 2uH_Wire_Shield_2A_4x4: Shielded Power Inductor 2.2 uH 20% 2.2 A 50.4 mohms 3.11 A (sat) 60MHz / 4018: 4x4x1.8mm; FabGroup: DCDC converter; FabOrder: 2
R1 = Res_0805_150K_1%_1/8W: Res size 0805 SMD mounting, low power / Yageo-RC0805FR-07150KL
R2 = Res_0603_100R_5%_100mW: Res size 0603 SMD mounting, low power
R3 = Res_0805_33K_1%_1/8W: Res size 0805 SMD mounting, low power
R4 R5 = Res_0603_0ohm: Res size 0603 SMD mounting, zero-ohm 0R Yageo RC0603JR-070RL; Tolerance: 5%; PowerDisipated: 100mW; FabGroup: LDO Regulator & LDO bypass; FabOrder: 12
U1 = IC AP3429_A dcdc buck: 1.0MHZ, 2A STEP-DOWN DC-DC BUCK CONVERTER, with latch-off protection
U2 = IC NCP562SQ18T1G LDO: Fixed output lowdropout linear regulator. / 1.8 V 80 mA; Type: LDO

## Sheet usb_port.SchDoc: USB connector and ESD protection circuit
size A4; Date: 2022-07-29; Author: Juan Del Pino Mena; Revision: 0.6; SheetNumber: 11; SheetTotal: 18; TitleBig: USB connector and ESD protection circuit; Desc_line1: USB is used as a programming interface, as well as a power source for the charging circuit. Since it's an external; Desc_line2: connector, it needs to have a protection circuit against electro-static discharge (ESD) and noise.
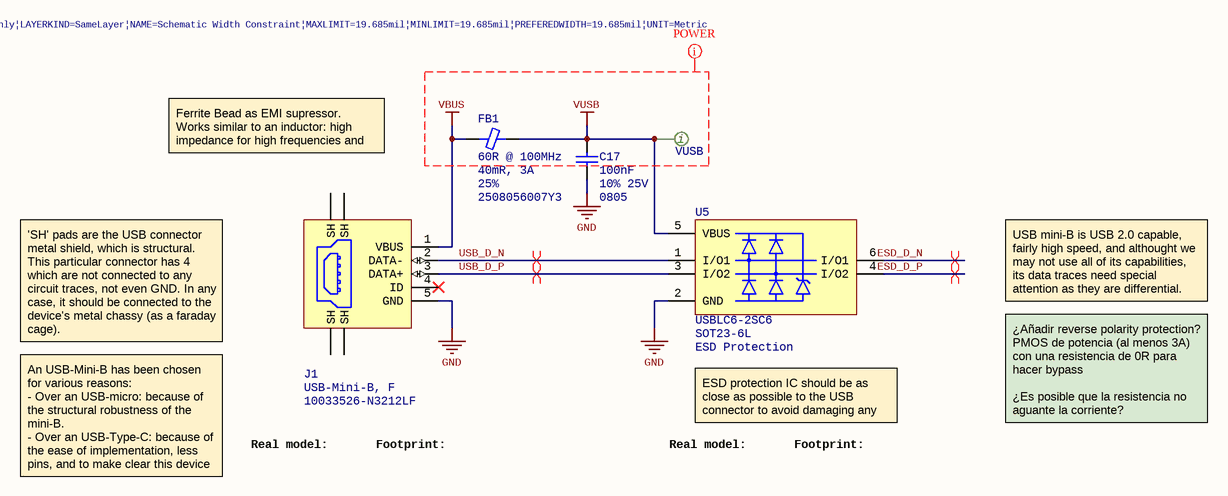
[diagram p6: usb_port.SchDoc]

### Parts
C17  value 100nF  Tolerance: 10% 25V  PackageDescription: 0805  [CAP 0805_2012]  (hidden comment: Cap_cer_0805)
FB1  value 40mR, 3A  Desc: 60R @ 100MHz  Tolerance: 25%  Part: 2508056007Y3  [FER 0805_2012]  (hidden comment: Ferrite Bead Chip Fair-Rite 2508056007Y3)
J1  PackageDescription: USB-Mini-B, F  Part: 10033526-N3212LF  [FCI USB Type B Mini 10033526-N3212LF]  (hidden comment: USB-MINI-B Female)
U5  Part: USBLC6-2SC6  PackageDescription: SOT23-6L  Type: ESD Protection  [SOT-23-6L USBLC6-2SC6]  (hidden comment: IC USBLC6-2SC6 ESD Prot)
VUSB  Test Point Pad dual sided  [TEST POINT PAD]  (value not drawn)

### Nets
GND: C17.1 J1.5(GND) U5.2(GND)
VBUS: FB1.1 J1.1(VBUS)
VUSB: C17.2 FB1.2 U5.5(VBUS) VUSB.1
ESD_D_N: U5.6(I/O1)
ESD_D_P: U5.4(I/O2)
USB_D_N: J1.2(DATA-) U5.1(I/O1)
USB_D_P: J1.3(DATA+) U5.3(I/O2)

Not connected (* = marked no-connect by the designer): J1 4(ID)* 6(SH) 7(SH) 8(SH) 9(SH)

### Layout directives
differential pair: ESD_D_N, ESD_D_P, USB_D_N, USB_D_P
net class POWER; rule Width Constraint [Pref Width = 0.5mm    Min Width = 0.5mm    Max Width = 0.5mm]: VBUS, VUSB

### Notes on the sheet
- Ferrite Bead as EMI supressor. Works similar to an inductor: high impedance for high frequencies and very low for DC
- 'SH' pads are the USB connector metal shield, which is structural. This particular connector has 4 which are not connected to any circuit traces, not even GND. In any case, it should be connected to the device's metal chassy (as a faraday cage).
- USB mini-B is USB 2.0 capable, fairly high speed, and althought we may not use all of its capabilities, its data traces need special attention as they are differential.
- ESD protection IC should be as close as possible to the USB connector to avoid damaging any other circuits.
- ¿Añadir reverse polarity protection?
  PMOS de potencia (al menos 3A) con una resistencia de 0R para hacer bypass
  ¿Es posible que la resistencia no aguante la corriente?
- An USB-Mini-B has been chosen for various reasons:
  - Over an USB-micro: because of the structural robustness of the mini-B.
  - Over an USB-Type-C: because of the ease of implementation, less pins, and to make clear this device is not a host.
- Real model:
- Footprint:
- Designer's signature
- Sheet title:
- Sr. Andrés Roldán Aranda
- Supervisor:
- Supervisor's signature
- Project title:
- Desginer:
- Dpto. Electrónica y Tecnología
- de Computadores
- University of Granada
- C/ Fuente Nueva, s/n, 18001
- Granada, Granada, Spain
- Date:
- Revision:
- Sheet
- of
- (in symbol Test Point Pad dual sided) i

### Library data of the parts
C17 = Cap_cer_0805_100nF_10%: Ceramic cap size 0805
FB1 = Ferrite Bead Chip Fair-Rite 2508056007Y3: 0805, 60Ω, 3A, 25% SMT
J1 = CON USB-MINI-B Female: USB-MINI-B Female, Manufacturer PN/ID: 10033526-N3212LF
U5 = IC USBLC6-2SC6 ESD Prot: Very low capacitance ESD protection; Value: *
VUSB = Test Point Pad dual sided: Test point - PCB Pad dual sided

## Sheet buttons.SchDoc: Buttons
size A4; Date: 2022-07-29; Author: Juan Del Pino Mena; Revision: 0.6; SheetNumber: 13; SheetTotal: 20; TitleBig: Buttons; Desc_line1: TIK buttons. Some of them are meant for debugging like boot mode selection and reset, and will not be accesible to; Desc_line2: the end user. The power-up button and the "thumb" button are meant to be part of the UI.
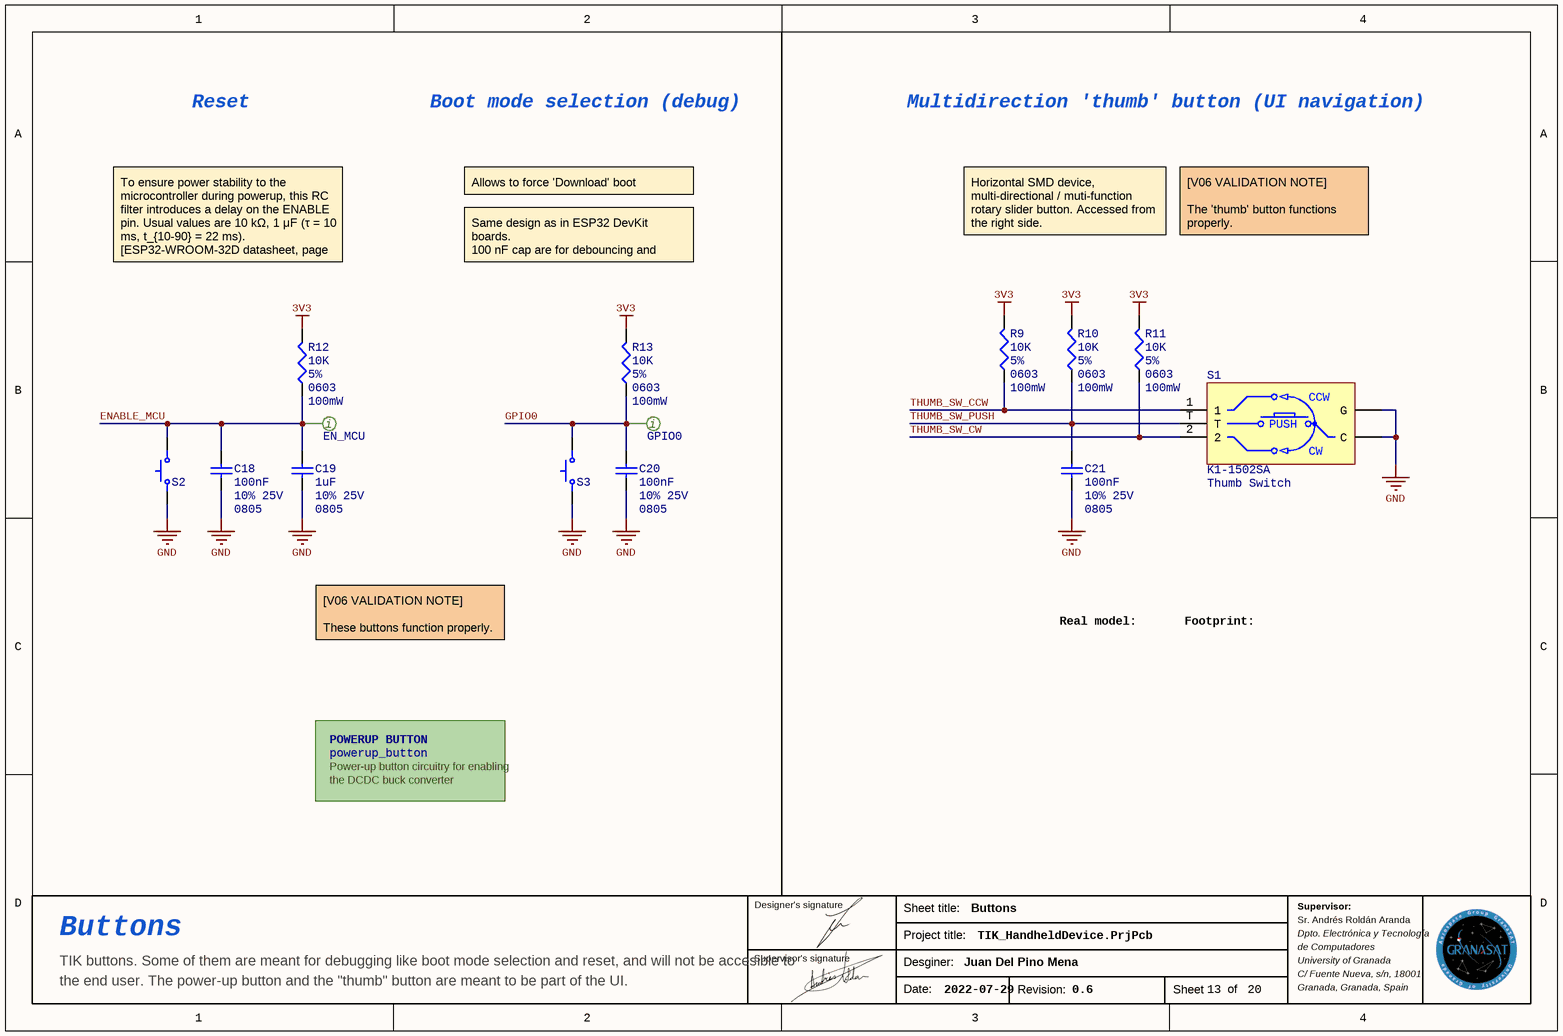
[diagram p7: buttons.SchDoc]

### Parts
C18  value 100nF  Tolerance: 10% 25V  PackageDescription: 0805  [CAP 0805_2012]  (hidden comment: Cap_cer_0805)
C19  value 1uF  Tolerance: 10% 25V  PackageDescription: 0805  [CAP 0805_2012]  (hidden comment: Cap_cer_0805)
C20  value 100nF  Tolerance: 10% 25V  PackageDescription: 0805  [CAP 0805_2012]  (hidden comment: Cap_cer_0805)
C21  value 100nF  Tolerance: 10% 25V  PackageDescription: 0805  [CAP 0805_2012]  (hidden comment: Cap_cer_0805)
EN_MCU  Test Point Pad dual sided  [TEST POINT PAD]  (value not drawn)  (no BOM)
GPIO0  Test Point Pad dual sided  [TEST POINT PAD]  (value not drawn)  (no BOM)
R9  value 10K  Tolerance: 5%  PackageDescription: 0603  PowerDisipated: 100mW  [RES 0603_1608]  (hidden comment: Res_0603_10K_5%_100mW_1)
R10  value 10K  Tolerance: 5%  PackageDescription: 0603  PowerDisipated: 100mW  [RES 0603_1608]  (hidden comment: Res_0603_10K_5%_100mW_1)
R11  value 10K  Tolerance: 5%  PackageDescription: 0603  PowerDisipated: 100mW  [RES 0603_1608]  (hidden comment: Res_0603_10K_5%_100mW_1)
R12  value 10K  Tolerance: 5%  PackageDescription: 0603  PowerDisipated: 100mW  [RES 0603_1608]  (hidden comment: Res_0603_10K_5%_100mW_1)
R13  value 10K  Tolerance: 5%  PackageDescription: 0603  PowerDisipated: 100mW  [RES 0603_1608]  (hidden comment: Res_0603_10K_5%_100mW_1)
S1  Part: K1-1502SA  Type: Thumb Switch  [SWITCH THUMB MULTIDIRECTION K1-1502SA-01]  (hidden comment: SWITCH Multidirection Slide Push Button SMD TS-003)
S2  Button  [button generic]  (value not drawn)
S3  Button  [button generic]  (value not drawn)

### Sub-sheets
POWERUP BUTTON = powerup_button: no entries

### Nets
3V3: R9.2 R10.2 R11.2 R12.2 R13.2
GND: C18.1 C19.1 C20.1 C21.1 S1.C S1.G S2.1 S3.1
ENABLE_MCU: C18.2 C19.2 EN_MCU.1 R12.1 S2.2
GPIO0: C20.2 GPIO0.1 R13.1 S3.2
THUMB_SW_CCW: R9.1 S1.1
THUMB_SW_CW: R11.1 S1.2
THUMB_SW_PUSH: C21.2 R10.1 S1.T

### Notes on the sheet
- Reset
- Boot mode selection (debug)
- Multidirection 'thumb' button (UI navigation)
- Allows to force 'Download' boot sequence
- Horizontal SMD device, multi-directional / muti-function rotary slider button. Accessed from the right side.
- [V06 VALIDATION NOTE]
  The 'thumb' button functions properly.
- To ensure power stability to the microcontroller during powerup, this RC filter introduces a delay on the ENABLE pin. Usual values are 10 kΩ, 1 μF (τ = 10 ms, t_{10-90} = 22 ms).
  [ESP32-WROOM-32D datasheet, page 22]
- Same design as in ESP32 DevKit boards.
  100 nF cap are for debouncing and should be placed close to the buttons
- [V06 VALIDATION NOTE]
  These buttons function properly.
- Real model:
- Footprint:
- Power-up button circuitry for enabling
- the DCDC buck converter
- Designer's signature
- Sheet title:
- Sr. Andrés Roldán Aranda
- Supervisor:
- Supervisor's signature
- Project title:
- Desginer:
- Dpto. Electrónica y Tecnología
- de Computadores
- University of Granada
- C/ Fuente Nueva, s/n, 18001
- Granada, Granada, Spain
- Date:
- Revision:
- Sheet
- of
- (in symbol SWITCH Multidirection Slide Push Button SMD TS-003) CCW; PUSH; CW
- (in symbol Test Point Pad dual sided) i

### Library data of the parts
C18 = Cap_cer_0805_100nF_10%: Ceramic cap size 0805; FabGroup: Buttons - Reset; FabOrder: 11
C19 = Cap_cer_0805_1uF_10%: Ceramic cap size 0805; FabGroup: Buttons - Reset; FabOrder: 11
C20 = Cap_cer_0805_100nF_10%: Ceramic cap size 0805; FabGroup: Buttons - Boot; FabOrder: 10
C21 = Cap_cer_0805_100nF_10%: Ceramic cap size 0805; FabGroup: Buttons - Multipurpose; FabOrder: 9
EN_MCU GPIO0 = Test Point Pad dual sided: Test point - PCB Pad dual sided
R9-R13 = Res_0603_10K_5%_100mW_1: Res size 0603 SMD mounting, low power
S1 = SWITCH Multidirection Slide Push Button SMD TS-003: FabGroup: Buttons - Multipurpose; FabOrder: 9
S2 = Button: Generic 2 pin button; FabGroup: Buttons - Reset; FabOrder: 11; PackageDescription: SMD 2-pin
S3 = Button: Generic 2 pin button; FabGroup: Buttons - Boot; FabOrder: 10; PackageDescription: SMD 2-pin

## Sheet powerup_button.SchDoc: Powerup button
size A4; SheetNumber: 14; SheetTotal: 20; TitleBig: Powerup button; Desc_line1: This circuit avoids using a power-up switch, which can shutdown the device without prior warning. The user pushes a; Desc_line2: button during a couple of seconds, in which the ESP32 will boot and keep the system on until a shutdown signal is sent.
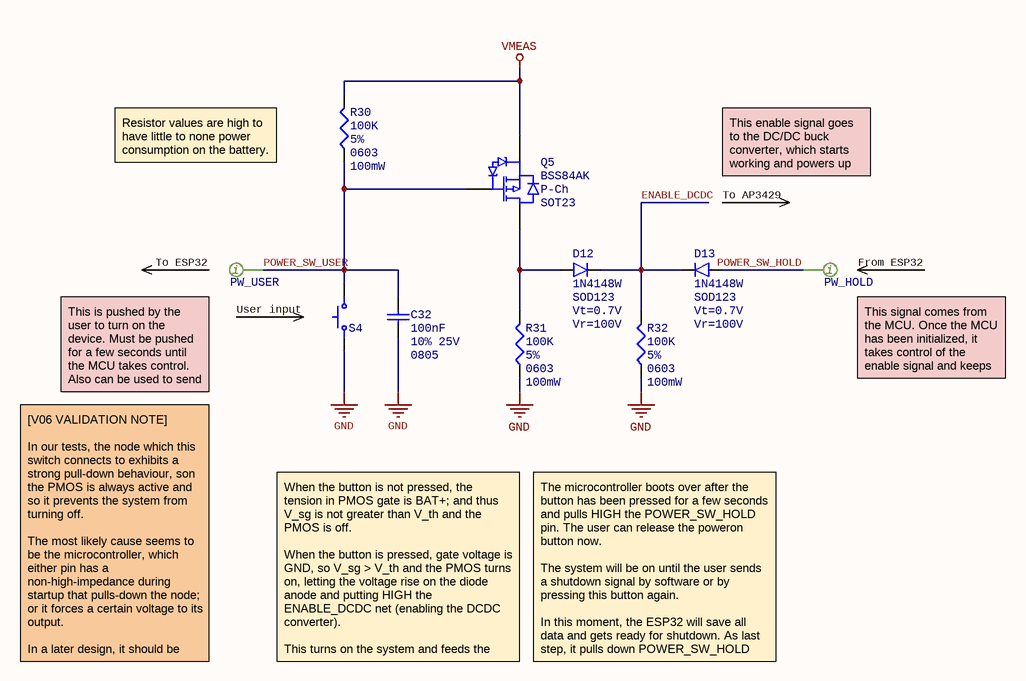
[diagram p8: powerup_button.SchDoc]

### Parts
C32  value 100nF  Tolerance: 10% 25V  PackageDescription: 0805  [CAP 0805_2012]  (hidden comment: Cap_cer_0805)
D12  Part: 1N4148W  PackageDescription: SOD123  ForwardVoltage: Vt=0.7V  ReverseVoltage: Vr=100V  [SOD123F 1N4148W]  (hidden comment: Diode 1N4148W)
D13  Part: 1N4148W  PackageDescription: SOD123  ForwardVoltage: Vt=0.7V  ReverseVoltage: Vr=100V  [SOD123F 1N4148W]  (hidden comment: Diode 1N4148W)
PW_HOLD  Test Point Pad dual sided  [TEST POINT PAD]  (value not drawn)  (no BOM)
PW_USER  Test Point Pad dual sided  [TEST POINT PAD]  (value not drawn)  (no BOM)
Q5  Part: BSS84AK  Type: P-Ch  PackageDescription: SOT23  [SOT-23-3 TO-236AB 2N7002]  (hidden comment: PMOS BSS84AK)
R30  value 100K  Tolerance: 5%  PackageDescription: 0603  PowerDisipated: 100mW  [RES 0603_1608]  (hidden comment: Res_0603_100K_5%_100mW)
R31  value 100K  Tolerance: 5%  PackageDescription: 0603  PowerDisipated: 100mW  [RES 0603_1608]  (hidden comment: Res_0603_100K_5%_100mW)
R32  value 100K  Tolerance: 5%  PackageDescription: 0603  PowerDisipated: 100mW  [RES 0603_1608]  (hidden comment: Res_0603_100K_5%_100mW)
S4  Button  [button generic]  (value not drawn)

### Nets
GND: C32.1 R31.1 R32.1 S4.1
VMEAS: Q5.2(S) R30.2
ENABLE_DCDC: D12.2 D13.2 R32.2
POWER_SW_HOLD: D13.1 PW_HOLD.1
POWER_SW_USER: C32.2 PW_USER.1 Q5.1(G) R30.1 S4.2
NetD12_1: D12.1 Q5.3(D) R31.2

### Notes on the sheet
- Resistor values are high to have little to none power consumption on the battery.
- This enable signal goes to the DC/DC buck converter, which starts working and powers up the system
- To AP3429
- (near PW_USER) To ESP32
- User input
- (near PW_HOLD) From ESP32
- (near PW_USER) This is pushed by the user to turn on the device. Must be pushed for a few seconds until the MCU takes control. Also can be used to send a shutdown signal.
- (near PW_HOLD) This signal comes from the MCU. Once the MCU has been initialized, it takes control of the enable signal and keeps the DC/DC ON.
- [V06 VALIDATION NOTE]
  In our tests, the node which this switch connects to exhibits a strong pull-down behaviour, son the PMOS is always active and so it prevents the system from turning off.
  The most likely cause seems to be the microcontroller, which either pin has a non-high-impedance during startup that pulls-down the node; or it forces a certain voltage to its output.
  In a later design, it should be tested on another pin.
- When the button is not pressed, the tension in PMOS gate is BAT+; and thus V_sg is not greater than V_th and the PMOS is off.
  When the button is pressed, gate voltage is GND, so V_sg > V_th and the PMOS turns on, letting the voltage rise on the diode anode and putting HIGH the ENABLE_DCDC net (enabling the DCDC converter).
  This turns on the system and feeds the ESP32 (continues →)
- The microcontroller boots over after the button has been pressed for a few seconds and pulls HIGH the POWER_SW_HOLD pin. The user can release the poweron button now.
  The system will be on until the user sends a shutdown signal by software or by pressing this button again.
  In this moment, the ESP32 will save all data and gets ready for shutdown. As last step, it pulls down POWER_SW_HOLD and the system powers off completely.
- Designer's signature
- Sheet title:
- Sr. Andrés Roldán Aranda
- Supervisor:
- Supervisor's signature
- Project title:
- Desginer:
- Dpto. Electrónica y Tecnología
- de Computadores
- University of Granada
- C/ Fuente Nueva, s/n, 18001
- Granada, Granada, Spain
- Date:
- Revision:
- Sheet
- of
- (in symbol Test Point Pad dual sided) i

### Library data of the parts
C32 = Cap_cer_0805_100nF_10%: Ceramic cap size 0805; FabGroup: Buttons - Powerup button; FabOrder: 3
D12 D13 = Diode 1N4148W: SURFACE MOUNT FAST SWITCHING DIODE; Type: Rectifier, General purpose; FabGroup: Buttons - Powerup button; FabOrder: 3
PW_HOLD PW_USER = Test Point Pad dual sided: Test point - PCB Pad dual sided
Q5 = PMOS BSS84AK: FabGroup: Buttons - Powerup button; FabOrder: 3; Value: *
R30-R32 = Res_0603_100K_5%_100mW: Res size 0603 SMD mounting, low power
S4 = Button: Generic 2 pin button; FabGroup: Buttons - Powerup button; FabOrder: 3; PackageDescription: SMD 2-pin